# Altium schematic sheet FTDI.SchDoc: USB Slot + FTDI
size 431 x 279 mm; Revision: 1.0; SheetNumber: 1; SheetTotal: 1
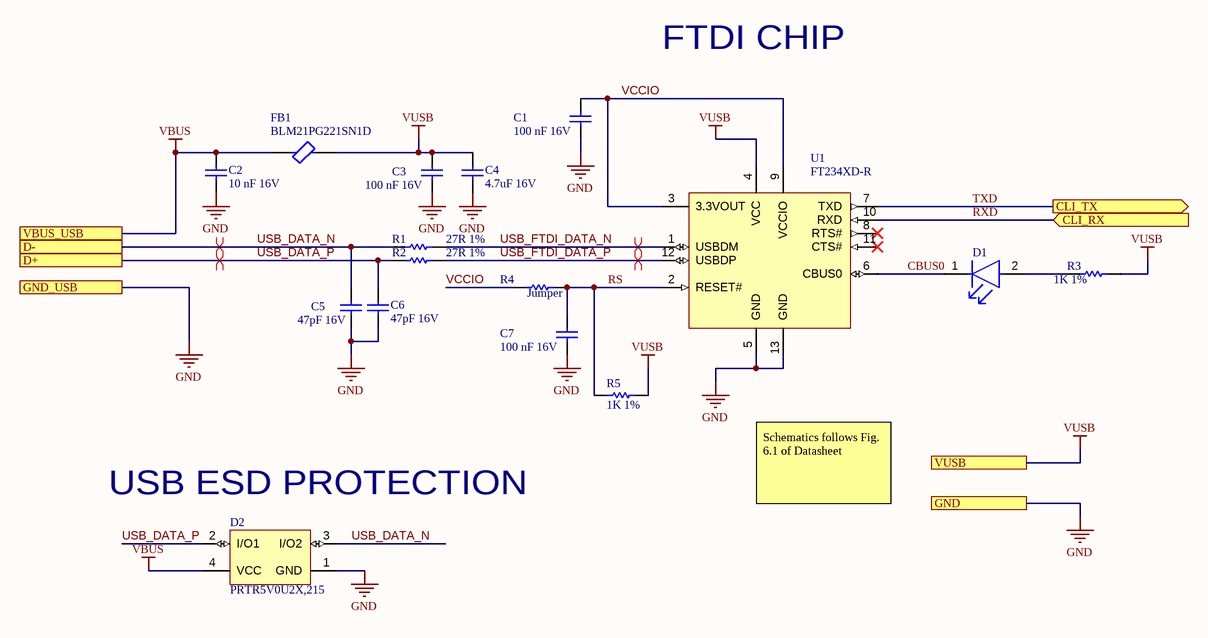
[diagram p0: FTDI.SchDoc]

## Parts
C1  100 nF 16V  [CAPC1608X95X40LL15T15]
C2  10 nF 16V  [CAPC1608X87X35NL15T15]
C3  100 nF 16V  [CAPC1608X95X40LL15T15]
C4  4.7uF 16V  [CAPC0805(2012)145_N]
C5  47pF 16V  [CAPC0603(1608)100_N]
C6  47pF 16V  [CAPC0603(1608)100_N]
C7  100 nF 16V  [CAPC1608X95X40LL15T15]
D1  LTST-C170CKT  [FP-LTST-C170CKT-MFG]  (value not drawn)
D2  PRTR5V0U2X,215  [NXP-SOT143B-4_V]
FB1  BLM21PG221SN1D  [FP-BLM21-0_2-t0_85-e0_5-IPC_A]
R1  27R 1%  [RESC0603(1608)_N]
R2  27R 1%  [RESC0603(1608)_N]
R3  1K 1%  [RESC1609X50X30LL10T20]
R4  Jumper  [RESC1609X50X30LL10T20]
R5  1K 1%  [RESC1609X50X30LL10T20]
U1  FT234XD-R  [DFN-12_V]

## Ports
CLI_RX (in), CLI_TX (out), D+, D-, GND, GND_USB, VBUS_USB, VUSB

## Nets
GND: C1.1 C2.1 C3.1 C4.1 C5.1 C6.1 C7.1 D2.1(GND) U1.5(GND) U1.13(GND) ; port GND, port GND_USB
VBUS: C2.2 D2.4(VCC) FB1.1 ; port VBUS_USB
VUSB: C3.2 C4.2 FB1.2 R3.2 R5.1 U1.4(VCC) ; port VUSB
CBUS0: D1.1(C) U1.6(CBUS0)
RS: C7.2 R4.2 R5.2 U1.2(RESET#)
RXD: U1.10(RXD) ; port CLI_RX
TXD: U1.7(TXD) ; port CLI_TX
USB_DATA_N: C5.2 D2.3(I/O2) R1.1 ; port D-
USB_DATA_P: C6.2 D2.2(I/O1) R2.1 ; port D+
USB_FTDI_DATA_N: R1.2 U1.1(USBDM)
USB_FTDI_DATA_P: R2.2 U1.12(USBDP)
VCCIO: C1.2 R4.1 U1.3(3.3VOUT) U1.9(VCCIO)
NetD1_2: D1.2(A) R3.1

Not connected (* = marked no-connect by the designer): U1 8(RTS#)* 11(CTS#)*

## Layout directives
differential pair: USB_DATA_N, USB_DATA_P, USB_FTDI_DATA_N, USB_FTDI_DATA_P

## Notes on the sheet
- FTDI CHIP
- (near D2) USB ESD PROTECTION
- Schematics follows Fig. 6.1 of Datasheet
- DWG. NO.
- REV.
- SHT.
- THIS DOCUMENT AND THE DATA DISCLOSED HEREIN OR HEREWITH IS THE PROPERTY OF ALTIUM LIMITED AND MAY BE FREELY DISTRIBUTED IN WHOLE. NO RIGHTS ARE RESERVED OR EXPRESS OR IMPLIED WARANTEE GIVEN.
- REVISION
- DESCRIPTION
- DATE
- APPROVED
- ENG:
- APPROVALS
- PROJECT
- DSN:
- CHK:
- REFERENCE DOCUMENTS
- PROJECT REVISION:
- TITLE
- DOCUMENT REVISION:
- DESIGN ITEM:
- BOM:
- FAB DWG:
- PCB DWG:
- ASSY DWG:
- SCALE:
- SIZE
- B
- CAGE CODE
- FILE NAME
- DWG NO.
- SHEET
- OF
- REV

## Library data of the parts
C1 C3 C7 = CMP-1035-02584-2: VJ0603Y104KXJCW1BC; Manufacturer: Vitramon; Part Number: VJ0603Y104KXJCW1BC
C2 = CMP-1035-02311-2: C0603C103K4RACTU; Manufacturer: Kemet; Part Number: C0603C103K4RACTU
C4 = CMP-1036-04893-1: CAP 4.7uF 16V -20% to +80% 0805 (2012 Metric) Thickness 1.45mm SMD; Case-Metric: 2012; Case-EIA: 0805; Max Thickness: 1.45 mm; Value: 4.7uF; Rated Voltage: 16 V; Tolerance: -20% to +80%; Technology: SMT
C5 C6 = CMP-1035-01048-1: CAP 47pF 16V ±0.5pF 0603 (1608 Metric) Thickness 1mm SMD; Case-EIA: 0603; Case-Metric: 1608; Tolerance: Â±0.5pF; Technology: SMT; Value: 47pF; Rated Voltage: 16 V; Max Thickness: 1 mm
D1 = CMP-1674-00001-6: LED RED CLEAR SMD; Dominant Wavelength: 638nm; Forward Current: 40mA; Forward Voltage: 1.8V; Lens Color: Colorless; Lens Style: Diffused; Luminous Intensity: 10mcd; Max Power Dissipation: 100mW; Number of Elements: 1; Reverse Voltage: 5V; Test Current: 10mA; Viewing Angle: 130°; Wavelength: 660nm; Package Quantity: 1; Packaging: Tape and Reel; Max Operating Temperature: 85°C; Min Operating Temperature: -55°C; Mount: Surface Mount; Length: 2mm; Height: 1.1mm; Case/Package: 0805; Case Code (Imperial): 0805; Case Code (Metric): 2012; Color: Red; Depth: 1.25mm; Illumination Color: Red; Lead Free: Lead Free; Lens Transparency: Clear; Number of LEDs: 1; Number of Pins: 2; Power Dissipation: 100mW; Power Rating: 100mW; Radiation Hardening: No; Voltage: 5V; Width: 1.25mm
D2 = CMP-2000-05285-1: Ultra Low Capacitance Double Rail-to-Rail ESD Protection Diode, 5.5 V, 1 pF, -40 to 85 degC, 4-Pin SOT143B, RoHS, Tape and Reel; Manufacturer: NXP Semiconductors; Capacitance Value: 16pF; Number of Elements: 1; Rad Hardened: No; Reverse Breakdown Voltage: 6V; Working Voltage (Max): 5.5V; Polarity: Uni-Directional; Configuration: Quad; Leakage Current: 0.1uA; Product Height (mm): 1mm; Suppressor Type: DiodeArrays; Product Length (mm): 3mm; Product Depth (mm): 1.4mm; ESD Protection Voltage: 8KV@ContactDisc; Package Type: SOT; Mounting: SurfaceMount; Packaging: TapeandReel; Datasheet Version: Rev. 02, 01/2008; Reverse Stand-off Voltage: 5.5V; Manufacturer URL: http://www.nxp.com/; Operating Temp Range: -40Cto85C; Operating Temperature Classification: Industrial; Working Voltage: 5.5V; Operating Temperature Min Deg. C: -40C; Datasheet URL: https://datasheet.ciiva.com/4479/prtr5v0u2x-102853-4479461.pdf; Leakage Current (Max): 0.1uA; Direction Type: Uni-Directional; Pin Count: 3+Tab; Operating Temperature Max Deg. C: 85C; Mounting Style: SurfaceMount; Package / Case: SOT
FB1 = CMP-0686-00610-3: Chip Ferrite Bead, 0805, 220Ω @ 100MHz, 0.045Ω, 25%, 2A; DC Resistance (DCR): 45mR; Impedance: 220R; Number of Circuits: 1; Shielding: Unshielded; Case/Package: 0805; Case Code (Imperial): 0805; Case Code (Metric): 2012; Contact Plating: Tin; Core Material: Ferrite; Current: 2A; Current Rating: 2A; DC Current: 2A; DC Resistance-Max: 45mR; Depth: 1.25mm; Frequency: 100MHz; Height: 0.85mm; Lead Free: Lead Free; Length: 2mm; Material: Ferrite; Max Current Rating: 2A; Max DC Current: 2A; Max Operating Temperature: 125°C; Military Standard: Not; Min Operating Temperature: -55°C; Number of Lines: 1; Number of Pins: 2; Package Quantity: 1; Packaging: Tape and Reel; Radiation Hardening: No; REACH SVHC: No SVHC; RoHS Compliant: Yes; Series: BLM21P; Termination: SMD/SMT; Test Frequency: 100MHz; Tolerance: 25%; Width: 1.25mm
R1 R2 = CMP-1012-00331-1: 27R 0.1W 1% 0603 (1608 Metric)  SMD; Case-EIA: 0603; Value: 27.00 Ohm; Case-Metric: 1608; Technology: SMT; Tolerance: 1 %; Power: 0.1 W
R3 R5 = CMP-1012-00510-2: CRCW06031K00FKEB; Manufacturer: Vishay Dale; Part Number: CRCW06031K00FKEB
R4 = CMP-1012-00001-2: Manufacturer: Vishay Dale; Part Number: CRCW06030000Z0EC
U1 = CMP-0248-00027-1: FT234XD USB to BASIC UART IC, -40 to +85 degC, 12-Pin DFN, Pb-Free, Tape and Reel; Manufacturer: FTDI; PackageReference: DFN-12; PackageVersion: Feb-13; DatasheetVersion: ver 1.1, Feb-2013; ComponentLink1URL: http://www.ftdichip.com/; PartNumber: FT234XD-R; ComponentLink2URL: http://www.ftdichip.com/Support/Documents/DataSheets/ICs/DS_FT234XD.pdf; ComponentLink1Description: Manufacturer URL; PackageDescription: 12-Pin Dual Flat No-Lead, 3 x 3 mm Body, 0.45 mm Pitch, Exposed Pad; ComponentLink2Description: Datasheet